# EAGLE schematic Charger Control Board rev7 (EAGLE 9.6.2)

## Sheet 1 of 3: Main
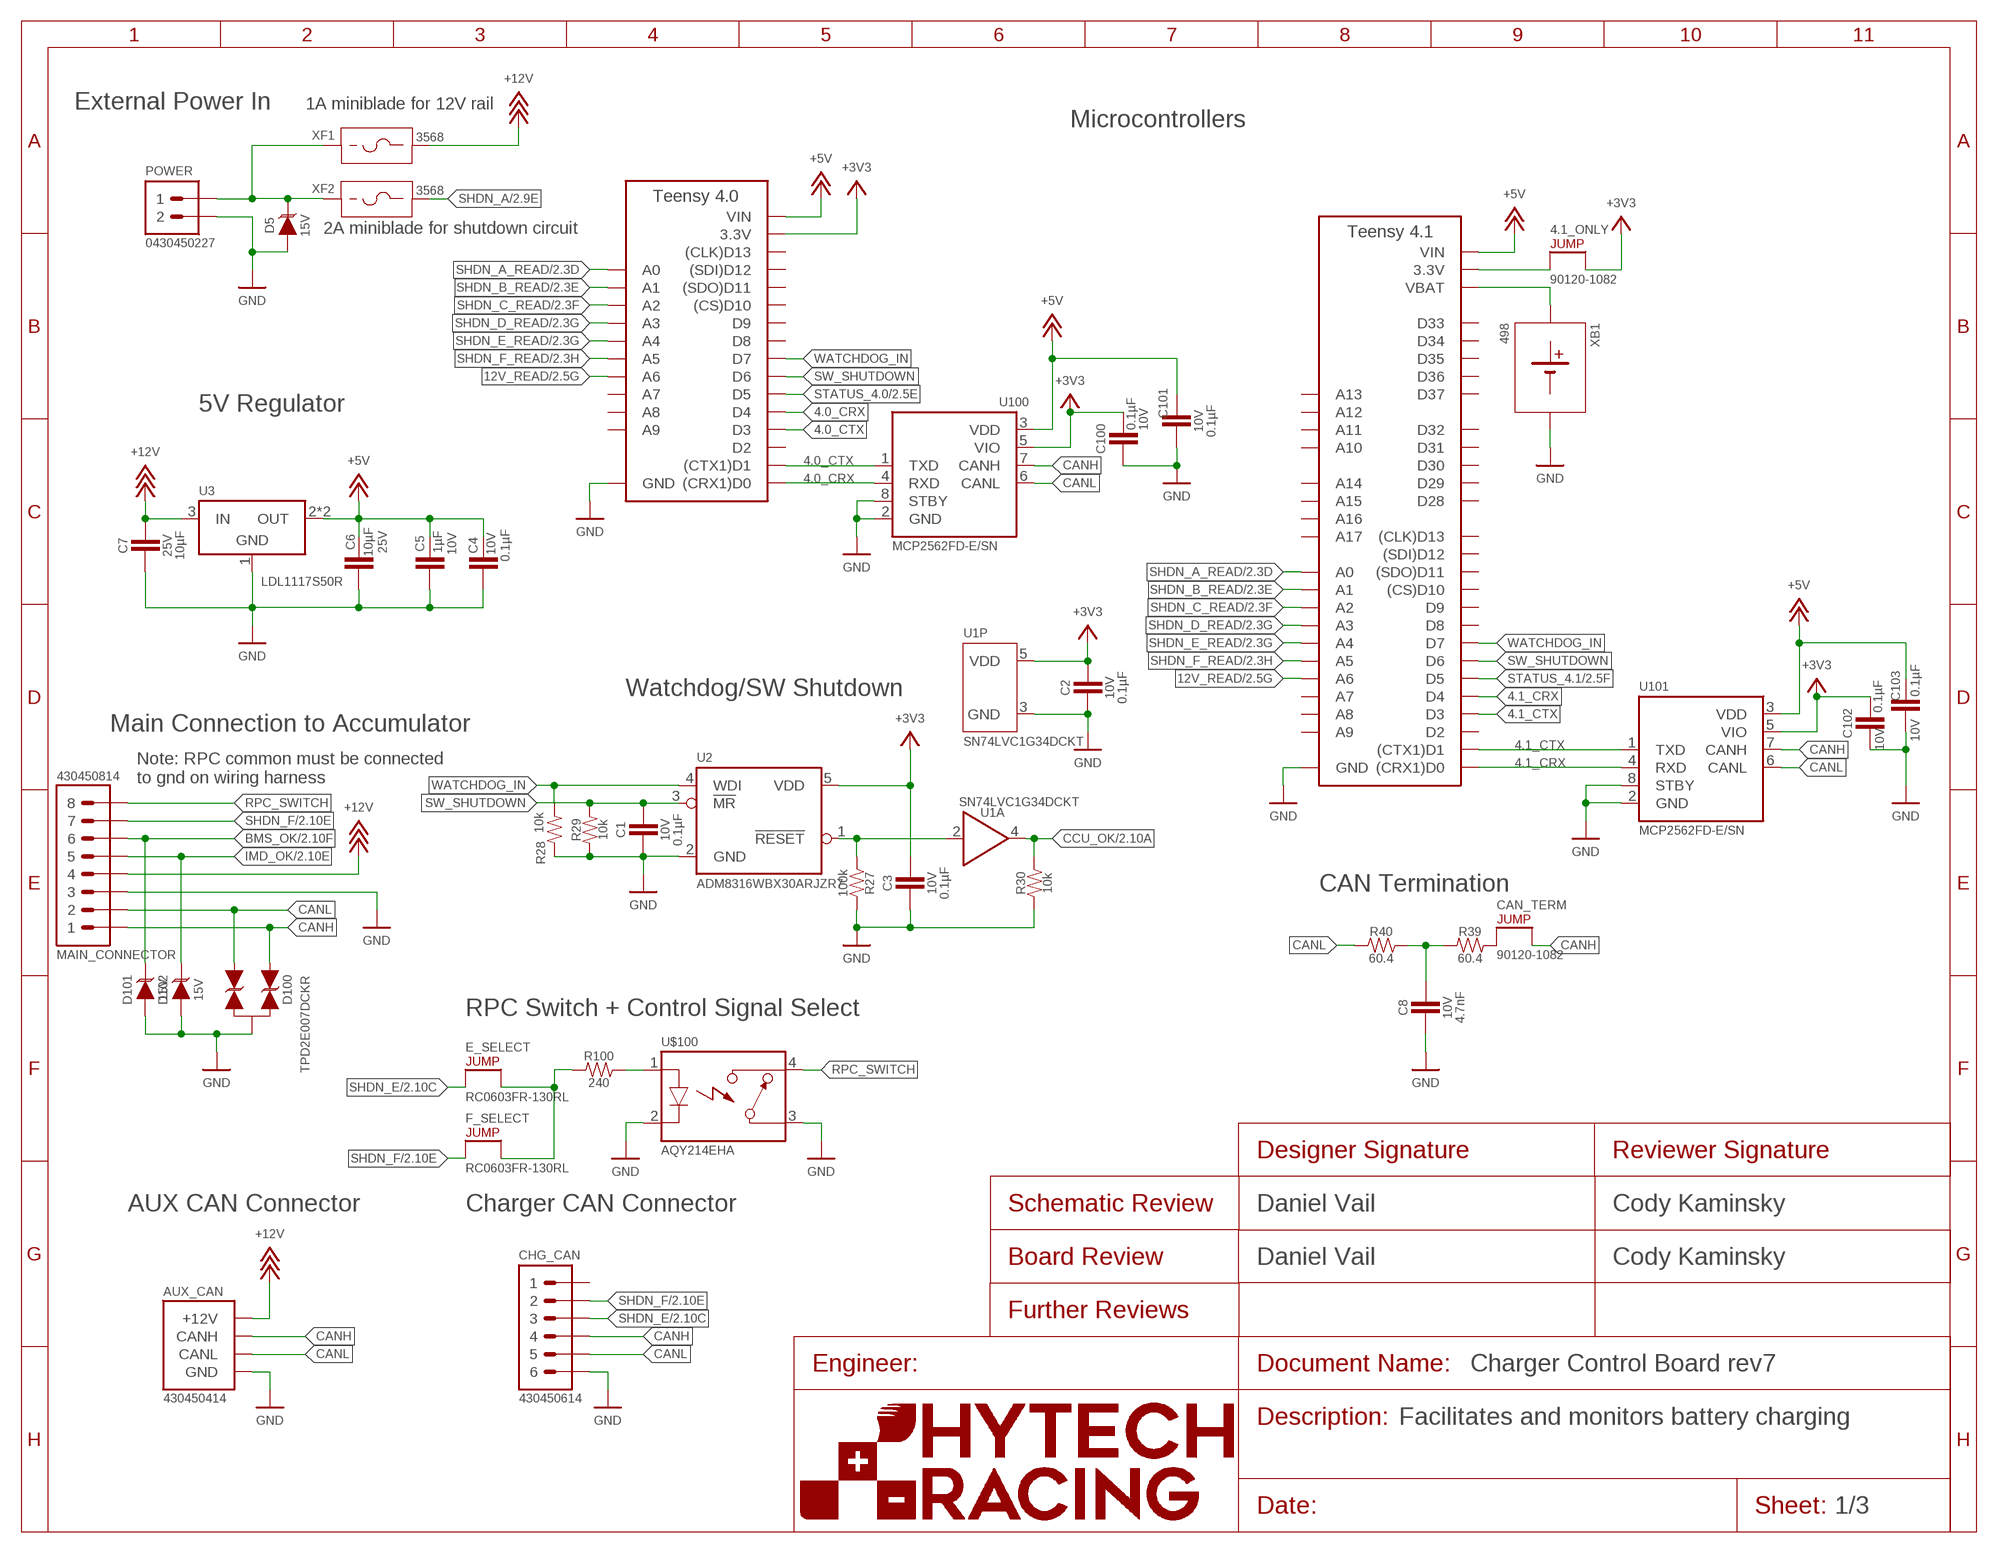
[diagram p0: schematic, sheet 1]
FRAME1 (FRAME): DESCRIPTION_1: Facilitates and monitors battery charging; DESIGNER_BOARD: Daniel Vail; DESIGNER_SCHEMATIC: Daniel Vail; REVIEWER_BOARD: Cody Kaminsky; REVIEWER_SCHEMATIC: Cody Kaminsky

### Parts
4.1_ONLY  JUMPER__1X02  [1X02]
A1  TEENSY_4.1  [TEENSY_LONG_EXT]
A2  TEENSY_4.0  [TEENSY_SHORT]
AUX_CAN  CONNECTOR-CAN_MF_T_V_  [MOLEX_MICROFIT_PTH_VERTICAL_04_DUAL]
C1  CAPACITOR_0603_10V_0.1UF  [0603-CAP]
C2  CAPACITOR_0603_10V_0.1UF  [0603-CAP]
C3  CAPACITOR_0603_10V_0.1UF  [0603-CAP]
C4  CAPACITOR_0603_10V_0.1UF  [0603-CAP]
C5  CAPACITOR_0603_10V_1UF  [0603-CAP]
C6  CAPACITOR_0603_25V_10UF  [0603-CAP]
C7  CAPACITOR_0603_25V_10UF  [0603-CAP]
C8  CAPACITOR_0603_10V_4.7NF  [0603-CAP]
C100  CAPACITOR_0603_10V_0.1UF  [0603-CAP]
C101  CAPACITOR_0603_10V_0.1UF  [0603-CAP]
C102  CAPACITOR_0603_10V_0.1UF  [0603-CAP]
C103  CAPACITOR_0603_10V_0.1UF  [0603-CAP]
CAN_TERM  JUMPER__1X02  [1X02]
CHG_CAN  CONNECTOR-6_MF_T_V_  [MOLEX_MICROFIT_PTH_VERTICAL_06_DUAL]
D5  TVS_15V  [SOT-23]
D100  TVS_BIDIRECTIONAL_DUAL  [SC-70-3]
D101  TVS_15V  [SOT-23]
D102  TVS_15V  [SOT-23]
E_SELECT  JUMPER_0603_  [0603-RES]
F_SELECT  JUMPER_0603_  [0603-RES]
MAIN_CONNECTOR  CONNECTOR-8_MF_T_V_  [MOLEX_MICROFIT_PTH_VERTICAL_08_DUAL]
POWER  CONNECTOR-2_μF_T_V_  [MOLEX_MICROFIT_PTH_VERTICAL_02_DUAL]
R27  RESISTOR_0603_100K  [0603-RES]
R28  RESISTOR_0603_10K  [0603-RES]
R29  RESISTOR_0603_10K  [0603-RES]
R30  RESISTOR_0603_10K  [0603-RES]
R39  RESISTOR_0603_60.4  [0603-RES]
R40  RESISTOR_0603_60.4  [0603-RES]
R100  RESISTOR_0603_240  [0603-RES]
U1  LOGICGATE_BUFFER  [SC-70-5]
U2  ADM8316WBX30  [SOT-23-5]
U3  VOLTAGE_REGULATOR_SOT-223_5V  [SOT-223]
U100  MCP2562FD  [SOIC-08(NARROW,0.15")]
U101  MCP2562FD  [SOIC-08(NARROW,0.15")]
U$100  RELAY_SOLIDSTATE_NO  [DIP-4]
XB1  BATTERY_HOLDER_KEYSTONE_498  [498]
XF1  FUSE_HOLDER_MINIBLADEPTH  [3568]
XF2  FUSE_HOLDER_MINIBLADEPTH  [3568]

### Nets
4.0_CRX: A2.D0((CRX1)D0) A2.D4 U100.4(RXD)
4.0_CTX: A2.D1((CTX1)D1) A2.D3 U100.1(TXD)
4.1_CRX: A1.D0((CRX1)D0) A1.D4 U101.4(RXD)
4.1_CTX: A1.D1((CTX1)D1) A1.D3 U101.1(TXD)
12V_READ: A1.D20(A6) A2.D20(A6) ; also sheet 2
+3V3: 4.1_ONLY.2 A2.3.3V C2.2 C3.2 C100.2 C102.2 U1.5(P:VDD) U2.5(VDD) U100.5(VIO) U101.5(VIO) ; also sheet 2
+5V: A1.VIN A2.VIN C4.2 C5.1 C6.1 C101.2 C103.2 U3.2(OUT) U3.4(OUT) U100.3(VDD) U101.3(VDD) ; also sheet 2
+12V: AUX_CAN.1(+12V) C7.1 MAIN_CONNECTOR.4 U3.3(IN) XF1.3 XF1.4 ; also sheet 2
BMS_OK: D101.3(C) MAIN_CONNECTOR.6 ; also sheet 2
CANH: AUX_CAN.4(CANH) CAN_TERM.2 CHG_CAN.4 D100.1(C1) MAIN_CONNECTOR.1 U100.7(CANH) U101.7(CANH)
CANL: AUX_CAN.3(CANL) CHG_CAN.5 D100.2(C2) MAIN_CONNECTOR.2 R40.1 U100.6(CANL) U101.6(CANL)
CCU_OK: R30.2 U1.4(A:OUT) ; also sheet 2
GND: A1.AGND/GND(GND) A1.GND A1.GND@2(GND) A2.AGND/GND(GND) A2.GND AUX_CAN.2(GND) C1.1 C2.1 C3.1 C4.1 C5.2 C6.2 C7.2 C8.2 C100.1 C101.1 C102.1 C103.1 CHG_CAN.6 D5.1(A) D100.3(A) D101.1(A) D102.1(A) MAIN_CONNECTOR.3 POWER.2 R27.2 R28.2 R29.1 R30.1 U1.3(P:GND) U2.2(GND) U3.1(GND) U100.2(GND) U100.8(STBY) U101.2(GND) U101.8(STBY) U$100.2(CONTROL-) U$100.3(CONTACT1) XB1.2(MINUS) ; also sheet 2
IMD_OK: D102.3(C) MAIN_CONNECTOR.5 ; also sheet 2
N$1: D5.3(C) POWER.1 XF1.1 XF1.2 XF2.1 XF2.2
N$2: R27.1 U1.2(A:IN) U2.1(!RESET!)
N$4: CAN_TERM.1 R39.2
N$5: E_SELECT.2 F_SELECT.2 R100.1
N$8: A1.VBAT XB1.1(PLUS)
N$9: C8.1 R39.1 R40.2
N$10: R100.2 U$100.1(CONTROL+)
N$36: 4.1_ONLY.1 A1.3V3(3.3V) A1.3V3@2(3.3V) A1.3V3@3(3.3V)
RPC_SWITCH: MAIN_CONNECTOR.8 U$100.4(CONTACT2)
SHDN_A: XF2.3 XF2.4 ; also sheet 2
SHDN_A_READ: A1.D14(A0) A2.D14(A0) ; also sheet 2
SHDN_B_READ: A1.D15(A1) A2.D15(A1) ; also sheet 2
SHDN_C_READ: A1.D16(A2) A2.D16(A2) ; also sheet 2
SHDN_D_READ: A1.D17(A3) A2.D17(A3) ; also sheet 2
SHDN_E: CHG_CAN.3 E_SELECT.1 ; also sheet 2
SHDN_E_READ: A1.D18(A4) A2.D18(A4) ; also sheet 2
SHDN_F: CHG_CAN.2 F_SELECT.1 MAIN_CONNECTOR.7 ; also sheet 2
SHDN_F_READ: A1.D19(A5) A2.D19(A5) ; also sheet 2
STATUS_4.0: A2.D5 ; also sheet 2
STATUS_4.1: A1.D5 ; also sheet 2
SW_SHUTDOWN: A1.D6 A2.D6 C1.2 R29.2 U2.3(!MR!)
WATCHDOG_IN: A1.D7 A2.D7 R28.1 U2.4(WDI)
Unconnected: A1.D2 A1.D8 A1.D9 A1.D10((CS)D10) A1.D11((SDO)D11) A1.D12((SDI)D12) A1.D13((CLK)D13) A1.D21(A7) A1.D22(A8) A1.D23(A9) A1.D24(A10) A1.D25(A11) A1.D26(A12) A1.D27(A13) A1.D28 A1.D29 A1.D30 A1.D31 A1.D32 A1.D33 A1.D34 A1.D35 A1.D36 A1.D37 A1.D38(A14) A1.D39(A15) A1.D40(A16) A1.D41(A17) A2.D2 A2.D8 A2.D9 A2.D10((CS)D10) A2.D11((SDO)D11) A2.D12((SDI)D12) A2.D13((CLK)D13) A2.D21(A7) A2.D22(A8) A2.D23(A9) CHG_CAN.1

### Notes on the sheet
- External Power In | 1A miniblade for 12V rail
- Microcontrollers
- 2A miniblade for shutdown circuit
- 5V Regulator
- Watchdog/SW Shutdown
- Main Connection to Accumulator
- Note: RPC common must be connected
  to gnd on wiring harness
- CAN Termination
- RPC Switch + Control Signal Select
- AUX CAN Connector | Charger CAN Connector

## Sheet 2 of 3: Shutdown Cicruit
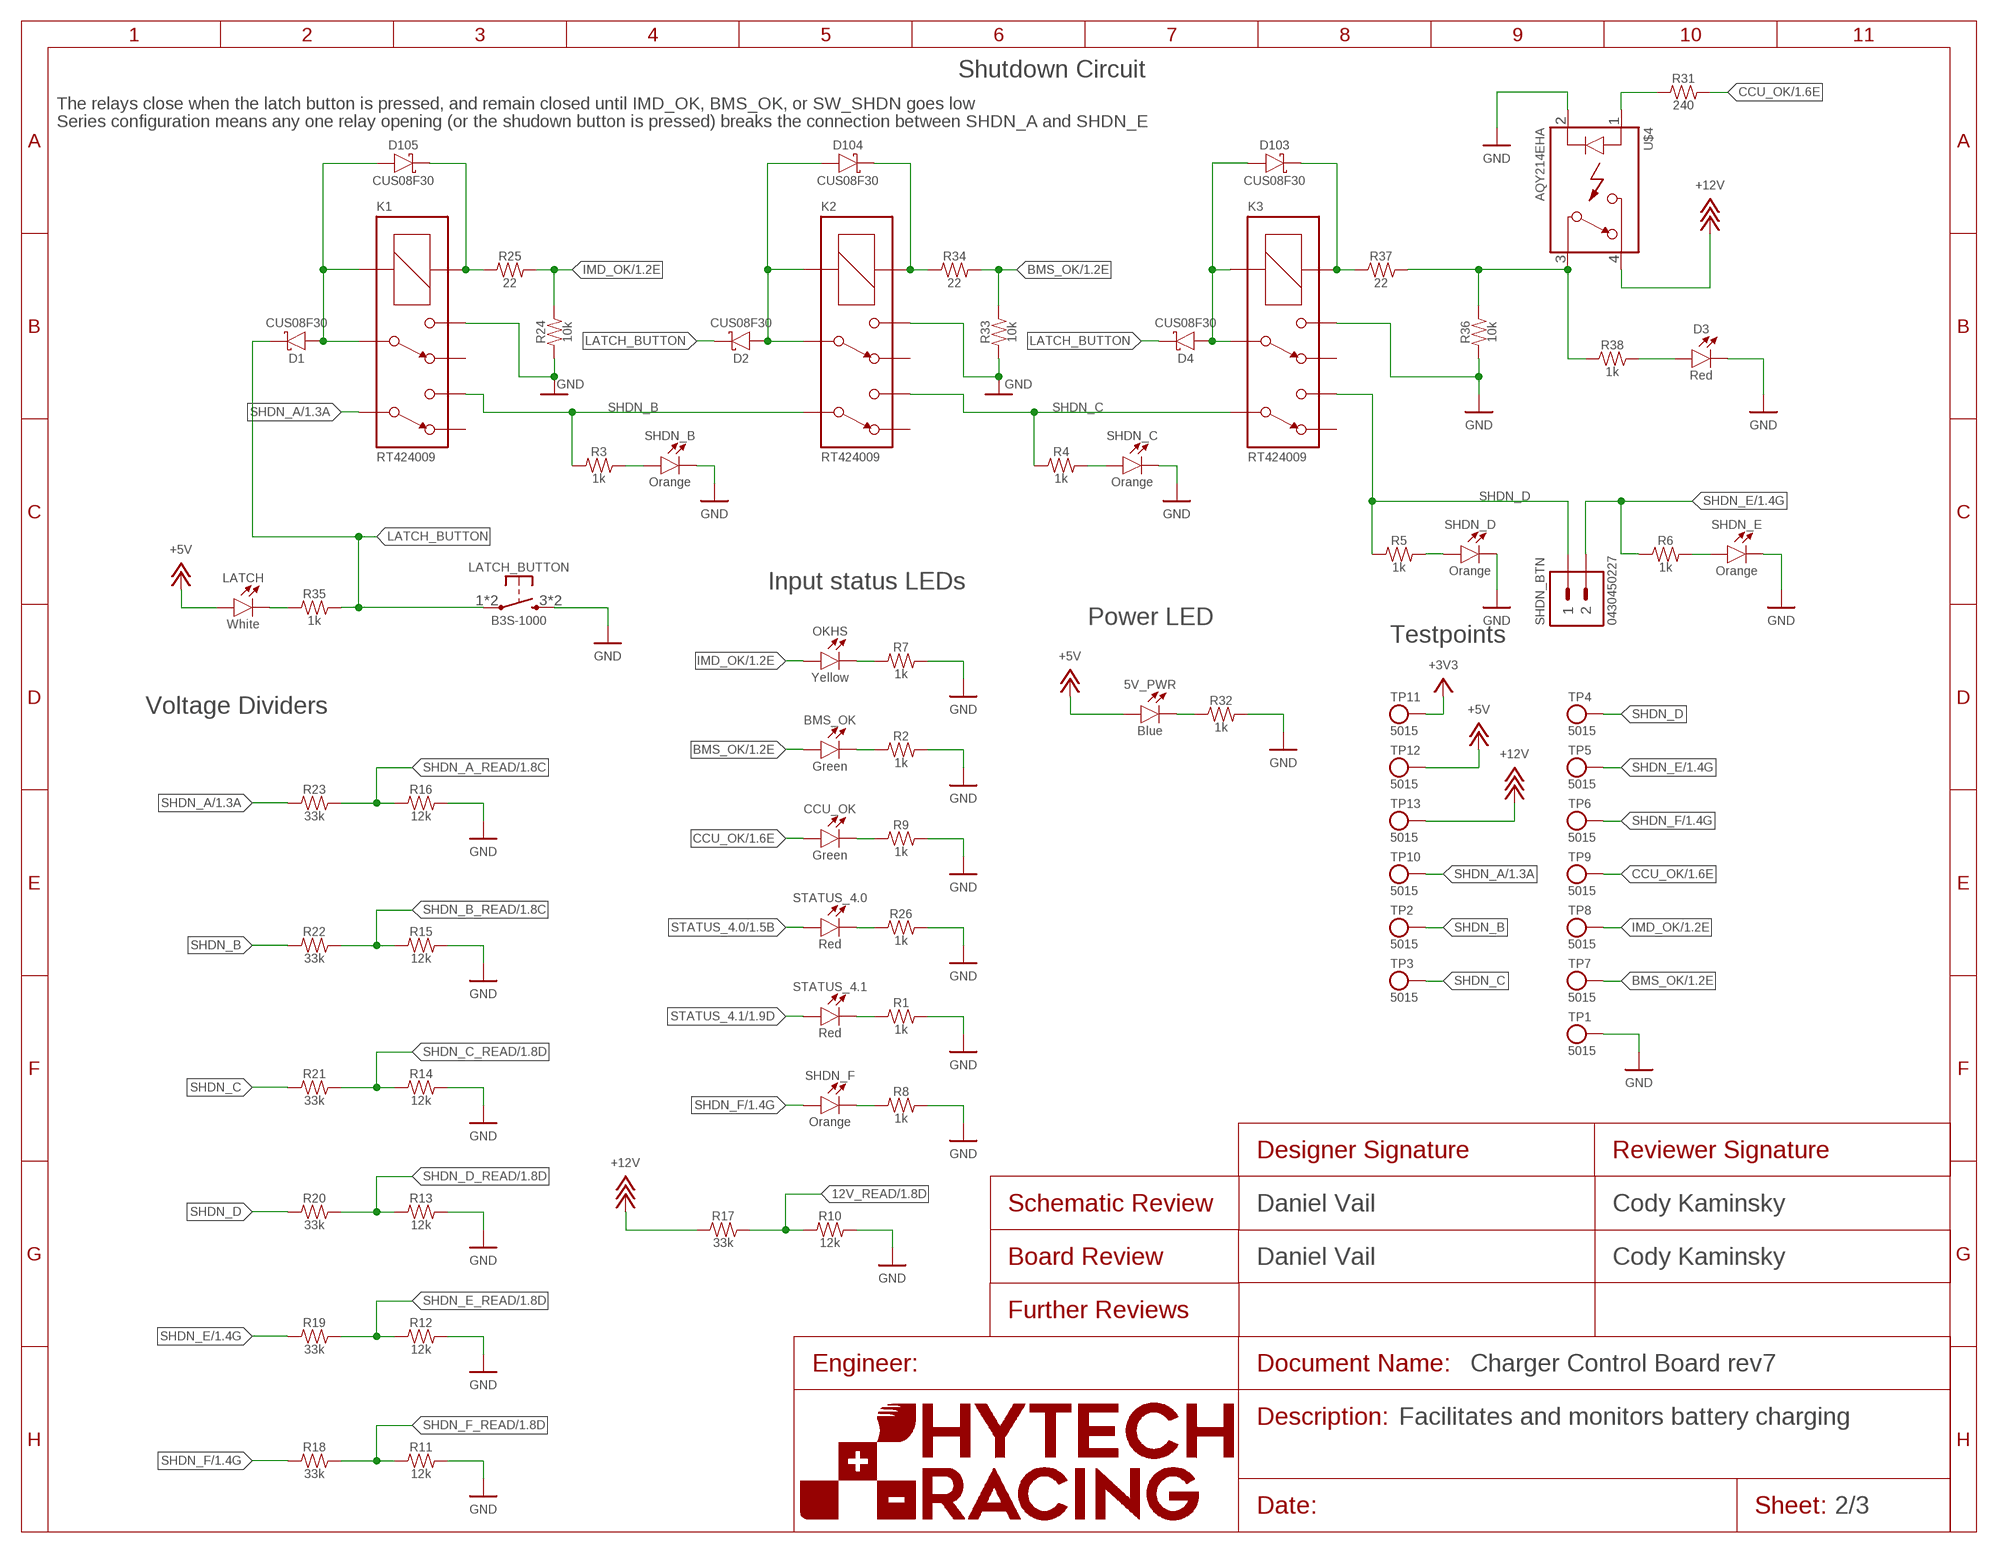
[diagram p1: schematic, sheet 2]
FRAME2 (FRAME): DESCRIPTION_1: Facilitates and monitors battery charging; DESIGNER_BOARD: Daniel Vail; DESIGNER_SCHEMATIC: Daniel Vail; REVIEWER_BOARD: Cody Kaminsky; REVIEWER_SCHEMATIC: Cody Kaminsky

### Parts
5V_PWR  LED_0603_BLUE  [0603-LED]
BMS_OK  LED_0603_GREEN  [0603-LED]
CCU_OK  LED_0603_GREEN  [0603-LED]
D1  SCHOTTKY_SOD323_30V  [SOD-323]
D2  SCHOTTKY_SOD323_30V  [SOD-323]
D3  LED_0603_RED  [0603-LED]
D4  SCHOTTKY_SOD323_30V  [SOD-323]
D103  SCHOTTKY_SOD323_30V  [SOD-323]
D104  SCHOTTKY_SOD323_30V  [SOD-323]
D105  SCHOTTKY_SOD323_30V  [SOD-323]
K1  RELAY_DPDT  [RT*2*]
K2  RELAY_DPDT  [RT*2*]
K3  RELAY_DPDT  [RT*2*]
LATCH  LED_0603_WHITE  [0603-LED]
LATCH_BUTTON  BUTTON  [B3S-100X]
OKHS  LED_0603_YELLOW  [0603-LED]
R1  RESISTOR_0603_1K  [0603-RES]
R2  RESISTOR_0603_1K  [0603-RES]
R3  RESISTOR_0603_1K  [0603-RES]
R4  RESISTOR_0603_1K  [0603-RES]
R5  RESISTOR_0603_1K  [0603-RES]
R6  RESISTOR_0603_1K  [0603-RES]
R7  RESISTOR_0603_1K  [0603-RES]
R8  RESISTOR_0603_1K  [0603-RES]
R9  RESISTOR_0603_1K  [0603-RES]
R10  RESISTOR_0603_12K  [0603-RES]
R11  RESISTOR_0603_12K  [0603-RES]
R12  RESISTOR_0603_12K  [0603-RES]
R13  RESISTOR_0603_12K  [0603-RES]
R14  RESISTOR_0603_12K  [0603-RES]
R15  RESISTOR_0603_12K  [0603-RES]
R16  RESISTOR_0603_12K  [0603-RES]
R17  RESISTOR_0603_33K  [0603-RES]
R18  RESISTOR_0603_33K  [0603-RES]
R19  RESISTOR_0603_33K  [0603-RES]
R20  RESISTOR_0603_33K  [0603-RES]
R21  RESISTOR_0603_33K  [0603-RES]
R22  RESISTOR_0603_33K  [0603-RES]
R23  RESISTOR_0603_33K  [0603-RES]
R24  RESISTOR_0603_10K  [0603-RES]
R25  RESISTOR_0603_22  [0603-RES]
R26  RESISTOR_0603_1K  [0603-RES]
R31  RESISTOR_0603_240  [0603-RES]
R32  RESISTOR_0603_1K  [0603-RES]
R33  RESISTOR_0603_10K  [0603-RES]
R34  RESISTOR_0603_22  [0603-RES]
R35  RESISTOR_0603_1K  [0603-RES]
R36  RESISTOR_0603_10K  [0603-RES]
R37  RESISTOR_0603_22  [0603-RES]
R38  RESISTOR_0603_1K  [0603-RES]
SHDN_B  LED_0603_ORANGE  [0603-LED]
SHDN_BTN  CONNECTOR-2_μF_T_V_  [MOLEX_MICROFIT_PTH_VERTICAL_02_DUAL]
SHDN_C  LED_0603_ORANGE  [0603-LED]
SHDN_D  LED_0603_ORANGE  [0603-LED]
SHDN_E  LED_0603_ORANGE  [0603-LED]
SHDN_F  LED_0603_ORANGE  [0603-LED]
STATUS_4.0  LED_0603_RED  [0603-LED]
STATUS_4.1  LED_0603_RED  [0603-LED]
TP1  TEST_POINT  [5015]
TP2  TEST_POINT  [5015]
TP3  TEST_POINT  [5015]
TP4  TEST_POINT  [5015]
TP5  TEST_POINT  [5015]
TP6  TEST_POINT  [5015]
TP7  TEST_POINT  [5015]
TP8  TEST_POINT  [5015]
TP9  TEST_POINT  [5015]
TP10  TEST_POINT  [5015]
TP11  TEST_POINT  [5015]
TP12  TEST_POINT  [5015]
TP13  TEST_POINT  [5015]
U$4  RELAY_SOLIDSTATE_NO  [DIP-4]

### Nets
12V_READ: R10.1 R17.2 ; also sheet 1
+3V3: TP11.1 ; also sheet 1
+5V: 5V_PWR.2(A) LATCH.2(A) TP12.1 ; also sheet 1
+12V: R17.1 TP13.1 U$4.4(CONTACT2) ; also sheet 1
BMS_OK: BMS_OK.2(A) R33.2 R34.2 TP7.1 ; also sheet 1
CCU_OK: CCU_OK.2(A) R31.2 TP9.1 ; also sheet 1
GND: D3.1(C) K1.14 K2.14 K3.14 LATCH_BUTTON.3(S) LATCH_BUTTON.4(S) R1.2 R2.2 R7.2 R8.2 R9.2 R10.2 R11.2 R12.2 R13.2 R14.2 R15.2 R16.2 R24.1 R26.2 R32.2 R33.1 R36.1 SHDN_B.1(C) SHDN_C.1(C) SHDN_D.1(C) SHDN_E.1(C) TP1.1 U$4.2(CONTROL-) ; also sheet 1
IMD_OK: OKHS.2(A) R24.2 R25.2 TP8.1 ; also sheet 1
LATCH_BUTTON: D1.C D2.C D4.C LATCH_BUTTON.1(P) LATCH_BUTTON.2(P) R35.2
N$3: R8.1 SHDN_F.1(C)
N$6: R31.1 U$4.1(CONTROL+)
N$11: D1.A D105.A K1.11 K1.A2(COIL-)
N$12: D105.C K1.A1(COIL+) R25.1
N$13: D104.C K2.A1(COIL+) R34.1
N$14: D2.A D104.A K2.11 K2.A2(COIL-)
N$15: D103.C K3.A1(COIL+) R37.1
N$16: R36.2 R37.2 R38.1 U$4.3(CONTACT1)
N$17: LATCH.1(C) R35.1
N$18: R5.2 SHDN_D.2(A)
N$19: R6.2 SHDN_E.2(A)
N$20: D4.A D103.A K3.11 K3.A2(COIL-)
N$21: D3.2(A) R38.2
N$22: R4.2 SHDN_C.2(A)
N$23: R3.2 SHDN_B.2(A)
N$29: OKHS.1(C) R7.1
N$30: BMS_OK.1(C) R2.1
N$31: CCU_OK.1(C) R9.1
N$33: R26.1 STATUS_4.0.1(C)
N$35: 5V_PWR.1(C) R32.1
N$39: R1.1 STATUS_4.1.1(C)
SHDN_A: K1.21 R23.1 TP10.1 ; also sheet 1
SHDN_A_READ: R16.1 R23.2 ; also sheet 1
SHDN_B: K1.24 K2.21 R3.1 R22.1 TP2.1
SHDN_B_READ: R15.1 R22.2 ; also sheet 1
SHDN_C: K2.24 K3.21 R4.1 R21.1 TP3.1
SHDN_C_READ: R14.1 R21.2 ; also sheet 1
SHDN_D: K3.24 R5.1 R20.1 SHDN_BTN.1 TP4.1
SHDN_D_READ: R13.1 R20.2 ; also sheet 1
SHDN_E: R6.1 R19.1 SHDN_BTN.2 TP5.1 ; also sheet 1
SHDN_E_READ: R12.1 R19.2 ; also sheet 1
SHDN_F: R18.1 SHDN_F.2(A) TP6.1 ; also sheet 1
SHDN_F_READ: R11.1 R18.2 ; also sheet 1
STATUS_4.0: STATUS_4.0.2(A) ; also sheet 1
STATUS_4.1: STATUS_4.1.2(A) ; also sheet 1
Unconnected: K1.12 K1.22 K2.12 K2.22 K3.12 K3.22

### Notes on the sheet
- Shutdown Circuit
- The relays close when the latch button is pressed, and remain closed until IMD_OK, BMS_OK, or SW_SHDN goes low
- Series configuration means any one relay opening (or the shudown button is pressed) breaks the connection between SHDN_A and SHDN_E
- Input status LEDs
- Power LED
- Testpoints
- Voltage Dividers

## Sheet 3 of 3: Ordering Components
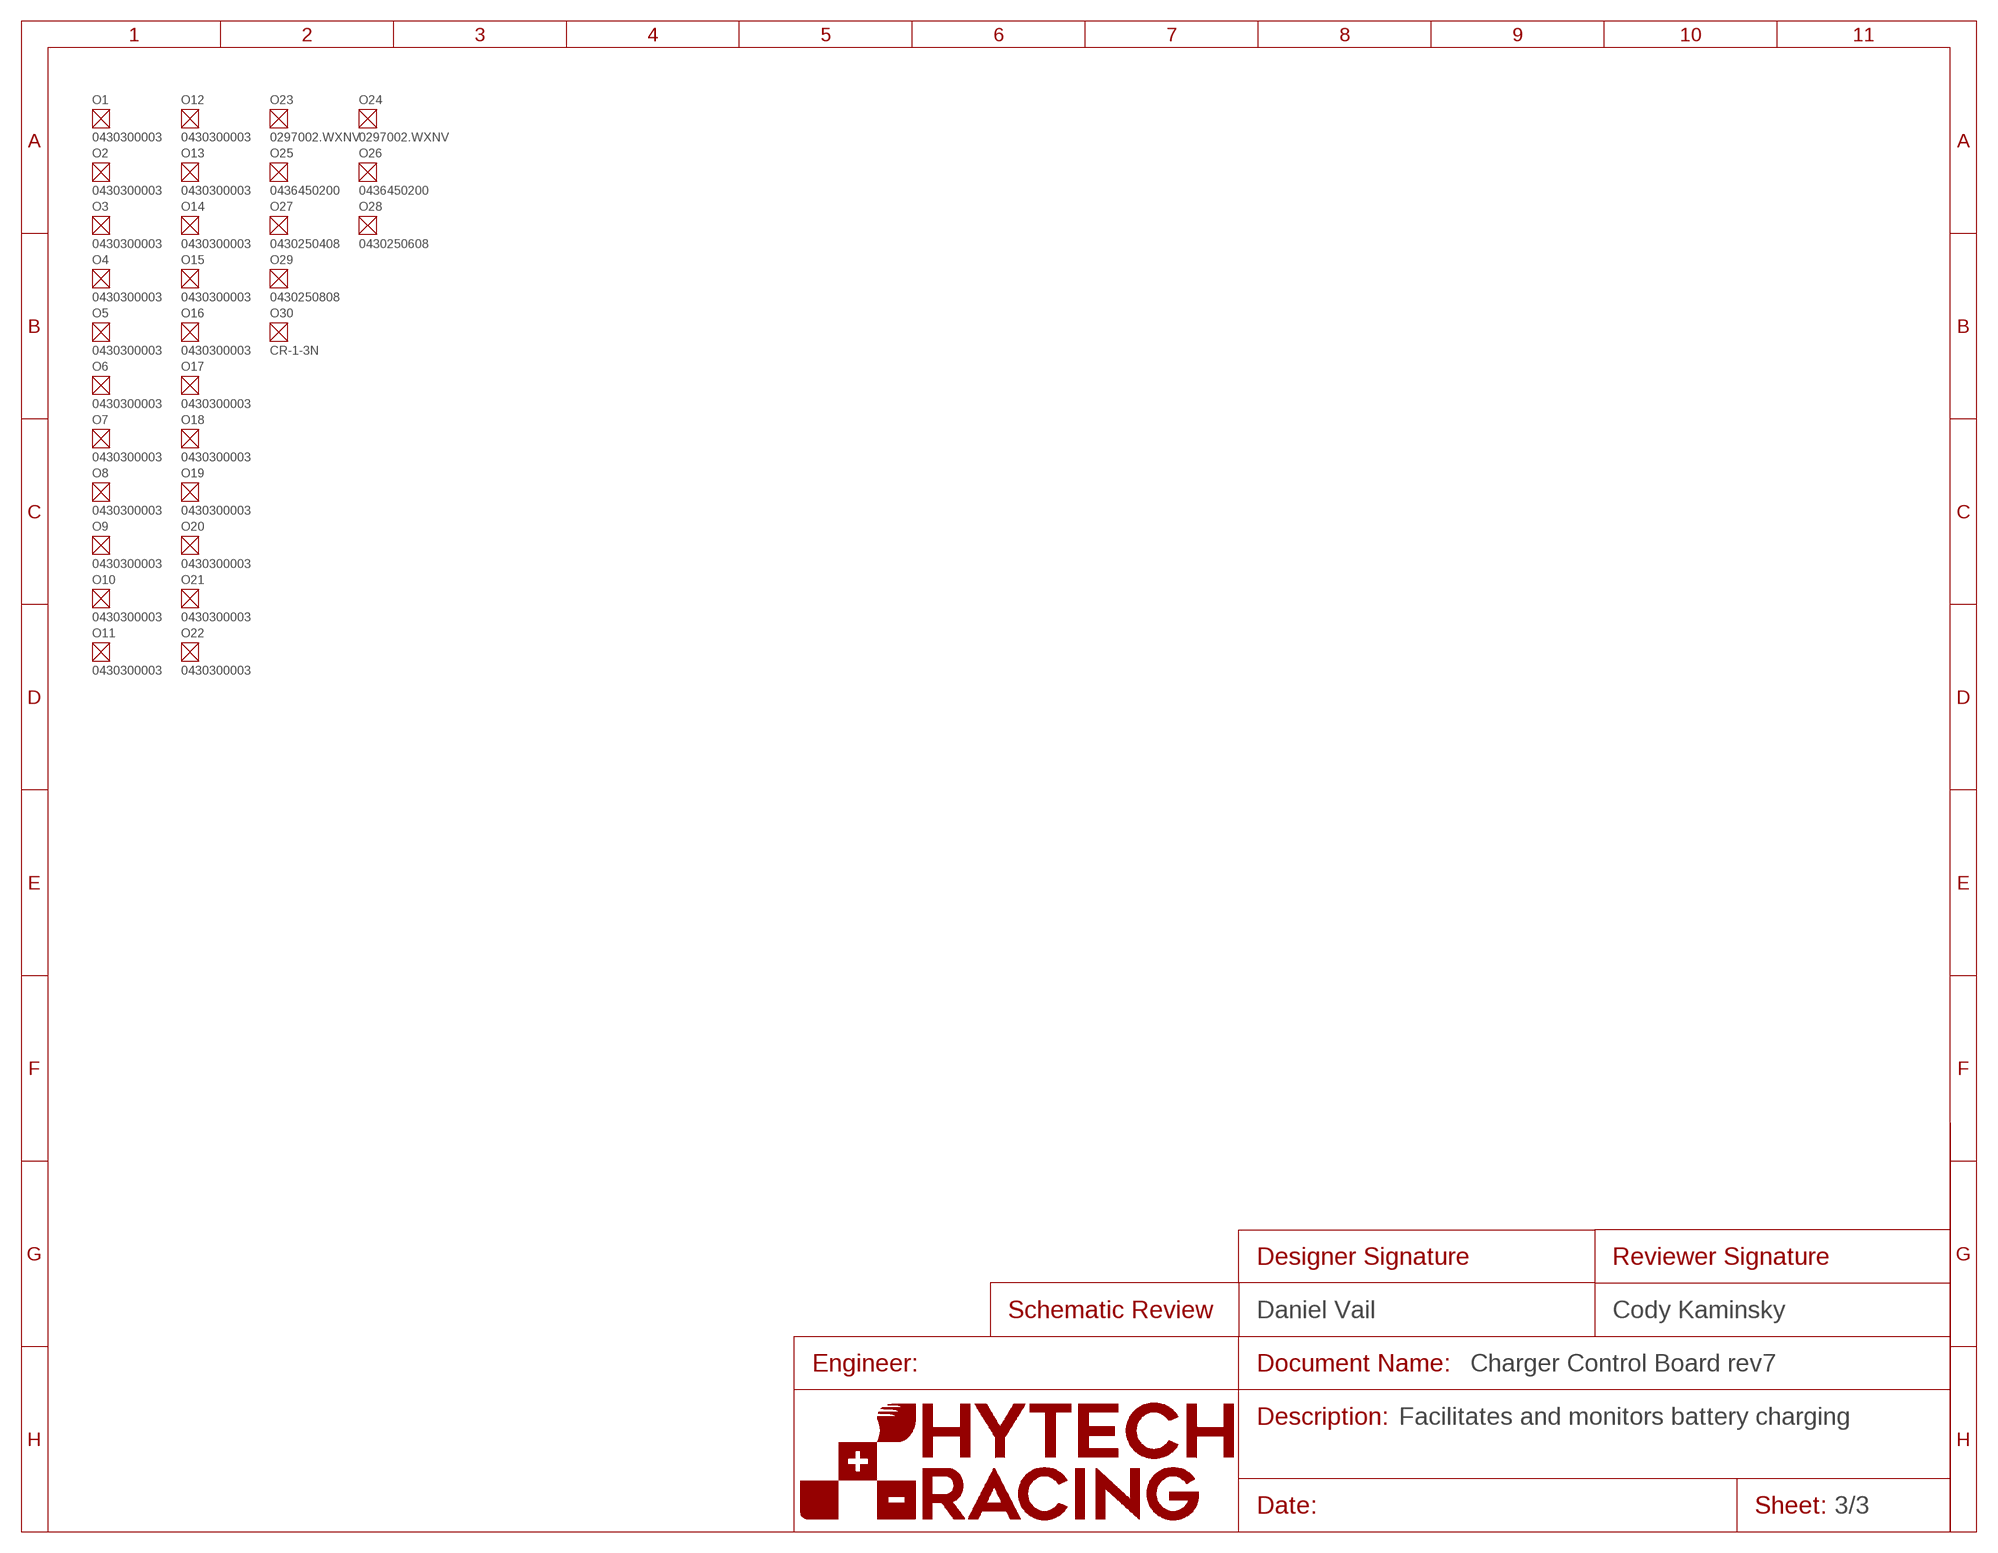
[diagram p2: schematic, sheet 3]
O1 (CRIMP_MICROFIT_20-24): DKPN: WM2776CT-ND; GAUGE: 20-24; MANUFACTURER: Molex; MOPN: 538-43030-0003; MPN: 0430300003
O2 (CRIMP_MICROFIT_20-24): DKPN: WM2776CT-ND; GAUGE: 20-24; MANUFACTURER: Molex; MOPN: 538-43030-0003; MPN: 0430300003
O3 (CRIMP_MICROFIT_20-24): DKPN: WM2776CT-ND; GAUGE: 20-24; MANUFACTURER: Molex; MOPN: 538-43030-0003; MPN: 0430300003
O4 (CRIMP_MICROFIT_20-24): DKPN: WM2776CT-ND; GAUGE: 20-24; MANUFACTURER: Molex; MOPN: 538-43030-0003; MPN: 0430300003
O5 (CRIMP_MICROFIT_20-24): DKPN: WM2776CT-ND; GAUGE: 20-24; MANUFACTURER: Molex; MOPN: 538-43030-0003; MPN: 0430300003
O6 (CRIMP_MICROFIT_20-24): DKPN: WM2776CT-ND; GAUGE: 20-24; MANUFACTURER: Molex; MOPN: 538-43030-0003; MPN: 0430300003
O7 (CRIMP_MICROFIT_20-24): DKPN: WM2776CT-ND; GAUGE: 20-24; MANUFACTURER: Molex; MOPN: 538-43030-0003; MPN: 0430300003
O8 (CRIMP_MICROFIT_20-24): DKPN: WM2776CT-ND; GAUGE: 20-24; MANUFACTURER: Molex; MOPN: 538-43030-0003; MPN: 0430300003
O9 (CRIMP_MICROFIT_20-24): DKPN: WM2776CT-ND; GAUGE: 20-24; MANUFACTURER: Molex; MOPN: 538-43030-0003; MPN: 0430300003
O10 (CRIMP_MICROFIT_20-24): DKPN: WM2776CT-ND; GAUGE: 20-24; MANUFACTURER: Molex; MOPN: 538-43030-0003; MPN: 0430300003
O11 (CRIMP_MICROFIT_20-24): DKPN: WM2776CT-ND; GAUGE: 20-24; MANUFACTURER: Molex; MOPN: 538-43030-0003; MPN: 0430300003
O12 (CRIMP_MICROFIT_20-24): DKPN: WM2776CT-ND; GAUGE: 20-24; MANUFACTURER: Molex; MOPN: 538-43030-0003; MPN: 0430300003
O13 (CRIMP_MICROFIT_20-24): DKPN: WM2776CT-ND; GAUGE: 20-24; MANUFACTURER: Molex; MOPN: 538-43030-0003; MPN: 0430300003
O14 (CRIMP_MICROFIT_20-24): DKPN: WM2776CT-ND; GAUGE: 20-24; MANUFACTURER: Molex; MOPN: 538-43030-0003; MPN: 0430300003
O15 (CRIMP_MICROFIT_20-24): DKPN: WM2776CT-ND; GAUGE: 20-24; MANUFACTURER: Molex; MOPN: 538-43030-0003; MPN: 0430300003
O16 (CRIMP_MICROFIT_20-24): DKPN: WM2776CT-ND; GAUGE: 20-24; MANUFACTURER: Molex; MOPN: 538-43030-0003; MPN: 0430300003
O17 (CRIMP_MICROFIT_20-24): DKPN: WM2776CT-ND; GAUGE: 20-24; MANUFACTURER: Molex; MOPN: 538-43030-0003; MPN: 0430300003
O18 (CRIMP_MICROFIT_20-24): DKPN: WM2776CT-ND; GAUGE: 20-24; MANUFACTURER: Molex; MOPN: 538-43030-0003; MPN: 0430300003
O19 (CRIMP_MICROFIT_20-24): DKPN: WM2776CT-ND; GAUGE: 20-24; MANUFACTURER: Molex; MOPN: 538-43030-0003; MPN: 0430300003
O20 (CRIMP_MICROFIT_20-24): DKPN: WM2776CT-ND; GAUGE: 20-24; MANUFACTURER: Molex; MOPN: 538-43030-0003; MPN: 0430300003
O21 (CRIMP_MICROFIT_20-24): DKPN: WM2776CT-ND; GAUGE: 20-24; MANUFACTURER: Molex; MOPN: 538-43030-0003; MPN: 0430300003
O22 (CRIMP_MICROFIT_20-24): DKPN: WM2776CT-ND; GAUGE: 20-24; MANUFACTURER: Molex; MOPN: 538-43030-0003; MPN: 0430300003
O23 (FUSE_MINI_BLADE_2): CURRENT: 2A; DKPN: F986-ND; FUSE_TYPE: MINI 297; MANUFACTURER: Littelfuse Inc.; MOPN: 576-0297002.WXNV; MPN: 0297002.WXNV
O24 (FUSE_MINI_BLADE_2): CURRENT: 2A; DKPN: F986-ND; FUSE_TYPE: MINI 297; MANUFACTURER: Littelfuse Inc.; MOPN: 576-0297002.WXNV; MPN: 0297002.WXNV
O25 (RECEPTACLE-2_MICROFIT): DKPN: WM1845-ND; MANUFACTURER: Molex; MOPN: 538-43645-0200; MPN: 0436450200
O26 (RECEPTACLE-2_MICROFIT): DKPN: WM1845-ND; MANUFACTURER: Molex; MOPN: 538-43645-0200; MPN: 0436450200
O27 (RECEPTACLE-4_MICROFIT): DKPN: WM11225-ND; MANUFACTURER: Molex; MOPN: 538-43025-0408; MPN: 0430250408
O28 (RECEPTACLE-6_MICROFIT): DKPN: WM13209-ND; MANUFACTURER: Molex; MOPN: 538-43025-0608; MPN: 0430250608
O29 (RECEPTACLE-8_MICROFIT): DKPN: WM13210-ND; MANUFACTURER: Molex; MOPN: 538-43025-0808; MPN: 0430250808
O30 (BATTERY_CR-1/3N): BATTERY_TYPE: 1/3N; DKPN: SY100-ND; MANUFACTURER: FDK America, Inc., a member of Fujitsu Group; MOPN: 639-CR1/3N; MPN: CR-1-3N; VOLTAGE: 3V
U$8 (FRAME_SCHEMATIC_ONLY): DESCRIPTION_1: Facilitates and monitors battery charging; DESIGNER_SCHEMATIC: Daniel Vail; REVIEWER_SCHEMATIC: Cody Kaminsky

## Library data of the parts
4.1_ONLY CAN_TERM = HyTechDevices_Jumper:JUMPER_?_*: 2 Pin Connector; DKPN: WM23656-ND; MANUFACTURER: Molex; MOPN: 538-90120-1082; MPN: 90120-1082
5V_PWR = HyTechDevices:LED_?_*: LED 0603 Blue Green Orange Red White Yellow 2835 (Series not on Digikey) Lumiled LUXEON 2835 Color Line; COLOR: Blue; DKPN: 754-1789-1-ND; MANUFACTURER: Kingbright; MOPN: 604-APT1608VBC/D; MPN: APT1608VBC/D
A1 = HyTechDevices:TEENSY_4.1: Teensy 4.1 with VBAT Datasheet Requires ordering of: 2: 24 pin, 0.1" pitch female headers 1: 2 pin, 0.1" pitch female headers; TEENSY: 4.1
A2 = HyTechDevices:TEENSY_4.0: Teensy 4.0 Datasheet Requires ordering of: 2: 14 pin, 0.1" pitch female headers; TEENSY: 4.0
AUX_CAN = HyTechDevices - Copy:CONNECTOR-CAN_?_*: HyTech CAN Connector; MANUFACTURER: Molex; MPN: 430450414
BMS_OK CCU_OK = HyTechDevices:LED_?_*: LED 0603 Blue Green Orange Red White Yellow 2835 (Series not on Digikey) Lumiled LUXEON 2835 Color Line; COLOR: Green; DKPN: 754-1790-1-ND; MANUFACTURER: Kingbright; MOPN: 604-APT1608ZGCK; MPN: APT1608ZGCK
C1-C4 C100-C103 = HyTechDevices:CAPACITOR_?_*: Capacitor, Non-Polarized VJ...1BC Series Datasheet Samsung Datasheet Walsin Datasheet GRM188R61A226ME15D GRM188R61E106MA73D 885012006013 2220Y6300105KXTWS2 Yageo Class 2, X5R TDK C Series AVX Automotive MLCC KEMET X7R Series Kyocera AVX; CAPACITANCE: 0.1µF; DKPN: 720-1688-1-ND; MANUFACTURER: Vishay Vitramon; MOPN: 77-VJ0603Y104JXQPBC; MPN: VJ0603Y104JXQPW1BC; TOLERANCE: 5%; VOLTAGE: 10V
C5 = HyTechDevices:CAPACITOR_?_*: Capacitor, Non-Polarized VJ...1BC Series Datasheet Samsung Datasheet Walsin Datasheet GRM188R61A226ME15D GRM188R61E106MA73D 885012006013 2220Y6300105KXTWS2 Yageo Class 2, X5R TDK C Series AVX Automotive MLCC KEMET X7R Series Kyocera AVX; CAPACITANCE: 1µF; DKPN: 311-1796-1-ND; MANUFACTURER: Yageo; MOPN: 603-CC603KRX7R6BB105; MPN: CC0603KRX7R6BB105; TOLERANCE: 10%; VOLTAGE: 10V
C6 C7 = HyTechDevices:CAPACITOR_?_*: Capacitor, Non-Polarized VJ...1BC Series Datasheet Samsung Datasheet Walsin Datasheet GRM188R61A226ME15D GRM188R61E106MA73D 885012006013 2220Y6300105KXTWS2 Yageo Class 2, X5R TDK C Series AVX Automotive MLCC KEMET X7R Series Kyocera AVX; CAPACITANCE: 10µF; DKPN: 490-7202-1-ND; MANUFACTURER: Murata Electronics; MOPN: 81-GRM188R61E106MA3D; MPN: GRM188R61E106MA73D; TOLERANCE: 20%; VOLTAGE: 25V
C8 = HyTechDevices:CAPACITOR_?_*: Capacitor, Non-Polarized VJ...1BC Series Datasheet Samsung Datasheet Walsin Datasheet GRM188R61A226ME15D GRM188R61E106MA73D 885012006013 2220Y6300105KXTWS2 Yageo Class 2, X5R TDK C Series AVX Automotive MLCC KEMET X7R Series Kyocera AVX; CAPACITANCE: 4.7nF; DKPN: 732-7931-1-ND; MANUFACTURER: Würth Elektronik; MOPN: 710-885012206012; MPN: 885012206012; TOLERANCE: 10%; VOLTAGE: 10V
CHG_CAN = HyTechDevices - Copy:CONNECTOR-6_?_*: 6 Pin Connector; MANUFACTURER: MOLEX; MPN: 430450614
D1 D2 D4 D103-D105 = HyTechDevices:SCHOTTKY_?_*: CUS08F30 Shottky Diode Datasheet; CURRENT: 0.8A; DKPN: CUS08F30H3FTR-ND; MANUFACTURER: Toshiba Semiconductor and Storage; MOPN: 757-CUS08F30H3F; MPN: CUS08F30; VOLTAGE: 30V
D3 STATUS_4.0 STATUS_4.1 = HyTechDevices:LED_?_*: LED 0603 Blue Green Orange Red White Yellow 2835 (Series not on Digikey) Lumiled LUXEON 2835 Color Line; COLOR: Red; DKPN: 754-1786-1-ND; MANUFACTURER: Kingbright; MOPN: 604-APT1608SECKJ3PRV; MPN: APT1608SECK/J3-PRV
D5 D101 D102 = HyTechDevices:TVS_*: TVS Diode GSOT Datasheet; DKPN: GSOT15-E3-08CT-ND; MANUFACTURER: Vishay General Semiconductor - Diodes Division; MOPN: 78-GSOT15-E3-08; MPN: GSOT15-E3-08; VOLTAGE: 15V
D100 = HyTechDevices:TVS_BIDIRECTIONAL_DUAL: Bdirectional TVS for CAN ESD Datasheet; DKPN: 296-25281-1-ND; MANUFACTURER: Texas Instruments; MOPN: 595-TPD2E007DCKR; MPN: TPD2E007DCKR
E_SELECT F_SELECT = HyTechDevices_Jumper:JUMPER_?_*: 2 Pin Connector; DKPN: 13-RC0603FR-130RLTR-ND; MANUFACTURER: YAGEO; MOPN: 603-RC0603FR-130RL; MPN: RC0603FR-130RL
K1-K3 = HyTechDevices:RELAY_DPDT: Dual Pole, Dual Throw Relay Datasheet; DKPN: PB2021-ND; MANUFACTURER: TE Connectivity; MOPN: 655-6-1393243-2; MPN: RT424009
LATCH = HyTechDevices:LED_?_*: LED 0603 Blue Green Orange Red White Yellow 2835 (Series not on Digikey) Lumiled LUXEON 2835 Color Line; COLOR: White; DKPN: SM0603UWC-ND; MANUFACTURER: Bivar Inc.; MOPN: 749-SM0603UWC; MPN: SM0603UWC
LATCH_BUTTON = HyTechDevices:BUTTON: Button Datasheet; DKPN: SW415-ND; MANUFACTURER: Omron; MOPN: 653-B3S-1000; MPN: B3S-1000
MAIN_CONNECTOR = HyTechDevices - Copy:CONNECTOR-8_?_*: 8 Pin Connector; MANUFACTURER: MOLEX; MPN: 430450814
OKHS = HyTechDevices:LED_?_*: LED 0603 Blue Green Orange Red White Yellow 2835 (Series not on Digikey) Lumiled LUXEON 2835 Color Line; COLOR: Yellow; DKPN: 754-1788-1-ND; MANUFACTURER: Kingbright; MOPN: 604-APT1608SYCK/J3-PRV; MPN: APT1608SYCK/J3-PRV
POWER SHDN_BTN = HyTechDevices:CONNECTOR-2_?_*: 2 Pin Connector; DKPN: WM10657-ND; MANUFACTURER: Molex; MOPN: 538-43045-0227; MPN: 0430450227
R1-R9 R26 R32 R35 R38 = HyTechDevices:RESISTOR_?_*: Resistor; DKPN: 311-1.00KHRCT-ND; MANUFACTURER: Yageo; MOPN: 603-RC0603FR-071KL; MPN: RC0603FR-071KL; POWER: 0.1W; RESISTANCE: 1k; TOLERANCE: 1%; VOLTAGE_CONTINUOUS: 10.00V; VOLTAGE_MAX: 75V
R10-R16 = HyTechDevices:RESISTOR_?_*: Resistor; DKPN: 311-12.0KHRCT-ND; MANUFACTURER: Yageo; MOPN: 603-RC0603FR-0712KL; MPN: RC0603FR-0712KL; POWER: 0.1W; RESISTANCE: 12k; TOLERANCE: 1%; VOLTAGE_CONTINUOUS: 34.64V; VOLTAGE_MAX: 75V
R17-R23 = HyTechDevices:RESISTOR_?_*: Resistor; DKPN: RHM33KAYTR-ND; MANUFACTURER: Rohm Semiconductor; MOPN: 755-KTR03EZPF3302; MPN: KTR03EZPF3302; POWER: 0.1W; RESISTANCE: 33k; TOLERANCE: 1%; VOLTAGE_CONTINUOUS: 57.4V; VOLTAGE_MAX: 350V
R24 R28-R30 R33 R36 = HyTechDevices:RESISTOR_?_*: Resistor; DKPN: 311-10.0KHRCT-ND; MANUFACTURER: Yageo; MOPN: 603-RC0603FR-0710KL; MPN: RC0603FR-0710KL; POWER: 0.1W; RESISTANCE: 10k; TOLERANCE: 1%; VOLTAGE_CONTINUOUS: 31.62V; VOLTAGE_MAX: 75V
R25 R34 R37 = HyTechDevices:RESISTOR_?_*: Resistor; DKPN: 311-22.0HRCT-ND; MANUFACTURER: Yageo; MOPN: 603-RC0603FR-0722RL; MPN: RC0603FR-0722RL; POWER: 0.1W; RESISTANCE: 22; TOLERANCE: 1%; VOLTAGE_CONTINUOUS: 1.48V; VOLTAGE_MAX: 75V
R27 = HyTechDevices:RESISTOR_?_*: Resistor; DKPN: 311-100KHRTR-ND; MANUFACTURER: Yageo; MOPN: 603-RC0603FR-07100KL; MPN: RC0603FR-07100KL; POWER: 0.1W; RESISTANCE: 100k; TOLERANCE: 1%; VOLTAGE_CONTINUOUS: 75V; VOLTAGE_MAX: 75V
R31 = HyTechDevices:RESISTOR_?_*: Resistor; DKPN: 311-240HRCT-ND; MANUFACTURER: Yageo; MOPN: 603-RC0603FR-07240RL; MPN: RC0603FR-07240RL; POWER: 0.1W; RESISTANCE: 240; TOLERANCE: 1%; VOLTAGE_CONTINUOUS: 4.90V; VOLTAGE_MAX: 75V
R39 R40 = HyTechDevices:RESISTOR_?_*: Resistor; DKPN: 311-60.4HRCT-ND; MANUFACTURER: Yageo; MOPN: 603-RC0603FR-0760R4L; MPN: RC0603FR-0760R4L; POWER: 0.1W; RESISTANCE: 60.4; TOLERANCE: 1%; VOLTAGE_CONTINUOUS: 2.48V; VOLTAGE_MAX: 75V
R100 = HyTechDevices_Jumper:RESISTOR_?_*: Resistor; DKPN: 311-240HRCT-ND; MANUFACTURER: Yageo; MOPN: 603-RC0603FR-07240RL; MPN: RC0603FR-07240RL; POWER: 0.1W; RESISTANCE: 240; TOLERANCE: 1%; VOLTAGE_CONTINUOUS: 4.90V; VOLTAGE_MAX: 75V
SHDN_B SHDN_C SHDN_D SHDN_E SHDN_F = HyTechDevices:LED_?_*: LED 0603 Blue Green Orange Red White Yellow 2835 (Series not on Digikey) Lumiled LUXEON 2835 Color Line; COLOR: Orange; DKPN: 754-1120-1-ND; MANUFACTURER: Kingbright; MOPN: 604-APT1608SECK; MPN: APT1608SECK
TP1 = HyTechDevices:TEST_POINT: Test Point for Probing; DKPN: 36-5015CT-ND; MANUFACTURER: Keystone Electronics; MOPN: 534-5015; MPN: 5015; SIGNAL: GND
TP2 = HyTechDevices:TEST_POINT: Test Point for Probing; DKPN: 36-5015CT-ND; MANUFACTURER: Keystone Electronics; MOPN: 534-5015; MPN: 5015; SIGNAL: SHDN_B
TP3 = HyTechDevices:TEST_POINT: Test Point for Probing; DKPN: 36-5015CT-ND; MANUFACTURER: Keystone Electronics; MOPN: 534-5015; MPN: 5015; SIGNAL: SHDN_C
TP4 = HyTechDevices:TEST_POINT: Test Point for Probing; DKPN: 36-5015CT-ND; MANUFACTURER: Keystone Electronics; MOPN: 534-5015; MPN: 5015; SIGNAL: SHDN_D
TP5 = HyTechDevices:TEST_POINT: Test Point for Probing; DKPN: 36-5015CT-ND; MANUFACTURER: Keystone Electronics; MOPN: 534-5015; MPN: 5015; SIGNAL: SHDN_E
TP6 = HyTechDevices:TEST_POINT: Test Point for Probing; DKPN: 36-5015CT-ND; MANUFACTURER: Keystone Electronics; MOPN: 534-5015; MPN: 5015; SIGNAL: SHDN_F
TP7 = HyTechDevices:TEST_POINT: Test Point for Probing; DKPN: 36-5015CT-ND; MANUFACTURER: Keystone Electronics; MOPN: 534-5015; MPN: 5015; SIGNAL: BMS_OK
TP8 = HyTechDevices:TEST_POINT: Test Point for Probing; DKPN: 36-5015CT-ND; MANUFACTURER: Keystone Electronics; MOPN: 534-5015; MPN: 5015; SIGNAL: IMD_OK
TP9 = HyTechDevices:TEST_POINT: Test Point for Probing; DKPN: 36-5015CT-ND; MANUFACTURER: Keystone Electronics; MOPN: 534-5015; MPN: 5015; SIGNAL: CCU_OK
TP10 = HyTechDevices:TEST_POINT: Test Point for Probing; DKPN: 36-5015CT-ND; MANUFACTURER: Keystone Electronics; MOPN: 534-5015; MPN: 5015; SIGNAL: SHDN_A
TP11 = HyTechDevices:TEST_POINT: Test Point for Probing; DKPN: 36-5015CT-ND; MANUFACTURER: Keystone Electronics; MOPN: 534-5015; MPN: 5015; SIGNAL: +3V3
TP12 = HyTechDevices:TEST_POINT: Test Point for Probing; DKPN: 36-5015CT-ND; MANUFACTURER: Keystone Electronics; MOPN: 534-5015; MPN: 5015; SIGNAL: +5V
TP13 = HyTechDevices:TEST_POINT: Test Point for Probing; DKPN: 36-5015CT-ND; MANUFACTURER: Keystone Electronics; MOPN: 534-5015; MPN: 5015; SIGNAL: +12V
U1 = HyTechDevices:LOGICGATE_BUFFER: Buffer SN74LVC Datasheet; DKPN: 296-26604-2-ND; MANUFACTURER: Texas Instruments; MOPN: 595-SN74LVC1G34DCKT; MPN: SN74LVC1G34DCKT
U2 = HyTechDevices:ADM8316; DKPN: ADM8316WBX30ARJZR7TR-ND; MANUFACTURER: Analog Devices Inc.; MOPN: 584-M8316WBX30ARJZR7; MPN: ADM8316WBX30ARJZR7
U3 = HyTechDevices:VOLTAGE_REGULATOR_?_*: Voltage Regulators LDL1117S50R Datasheet NCP785AH120T1G LMS8117A Datasheet; DKPN: 497-17240-1-ND; MANUFACTURER: STMicroelectronics; MOPN: 511-LDL1117S50R; MPN: LDL1117S50R
U100 U101 = HyTechDevices:MCP2562FD: MCP2562FD Can Tranciever Datasheet; ALT_DKPN: MCP2562-E/SN-ND; ALT_MANUFACTURER: Microchip Technology; ALT_MOPN: 579-MCP2562-E/SN; ALT_MPN: MCP2562-E/SN; DKPN: MCP2562FD-E/SN-ND; MANUFACTURER: Microchip Technology; MOPN: 579-MCP2562FD-E/SN; MPN: MCP2562FD-E/SN
U$4 U$100 = HyTechDevices:RELAY_SOLIDSTATE_NO: AQY214EH Normally Open Solid State Relay Datasheet <https://www.datasheetq.com/datasheet-download/287654/1/Panasonic/AQY214EH>; DKPN: 255-1436-5-ND; MANUFACTURER: AQY214EHA; MOPN: 769-AQY214EHA; MPN: AQY214EHA
XB1 = HyTechDevices:BATTERY_HOLDER_*: Keystone 498 1/3N Cell Holder PN for the holder; if 1/3N batteries needed, order separately. Datasheet; BATTERY_TYPE: 1/3N; DKPN: 36-498-ND; MANUFACTURER: Keystone Electronics; MOPN: 534-498; MPN: 498
XF1 XF2 = HyTechDevices:FUSE_HOLDER_*: Fuse Holder All PNs for the holder; if Miniblade Fuses needed, order separately. Mini-Blade PTH Mini-Blade SMD; DKPN: 36-3568-ND; MANUFACTURER: Keystone; MOPN: 534-3568; MPN: 3568